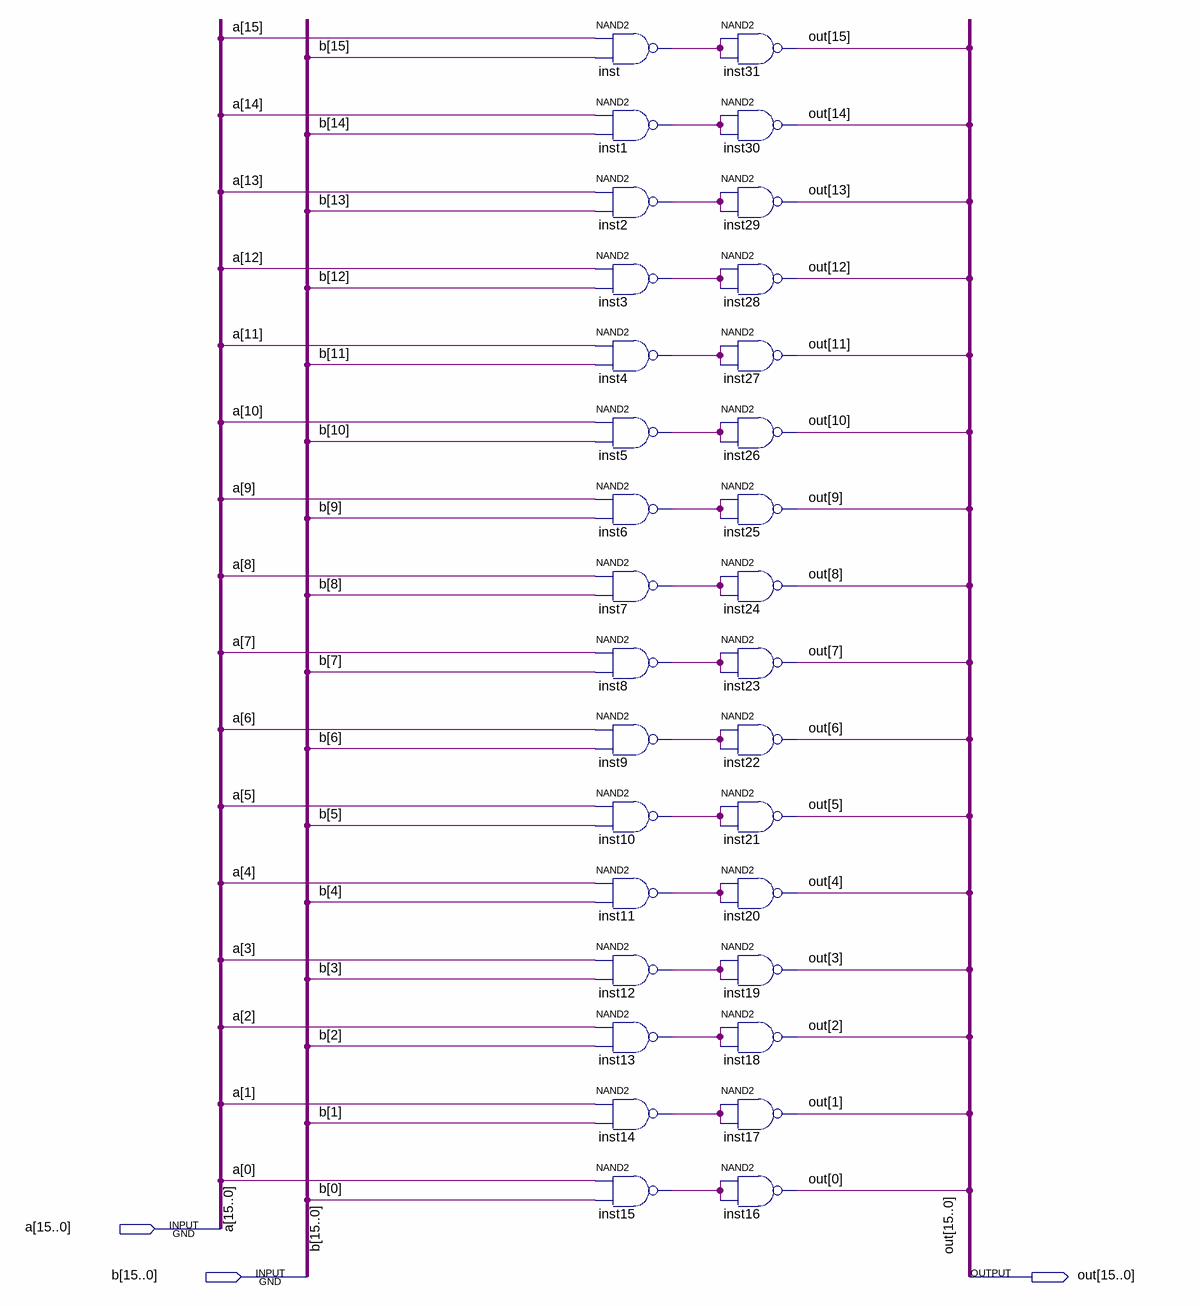
[diagram p0: schematic sheet]
// Quartus schematic And16.bdf as structural Verilog: 32 symbols, 3 pins
module And16 (
  input  [15:0] a,
  input  [15:0] b,
  output [15:0] out
);

  wire inst1_out, inst2_out, inst3_out, inst4_out, inst5_out, inst6_out, inst7_out, inst8_out, inst9_out,
       inst10_out, inst11_out, inst12_out, inst13_out, inst14_out, inst15_out, inst_out;

  nand inst (inst_out, a[15], b[15]);
  nand inst1 (inst1_out, a[14], b[14]);
  nand inst2 (inst2_out, a[13], b[13]);
  nand inst3 (inst3_out, a[12], b[12]);
  nand inst4 (inst4_out, a[11], b[11]);
  nand inst5 (inst5_out, a[10], b[10]);
  nand inst6 (inst6_out, a[9], b[9]);
  nand inst7 (inst7_out, a[8], b[8]);
  nand inst8 (inst8_out, a[7], b[7]);
  nand inst9 (inst9_out, a[6], b[6]);
  nand inst10 (inst10_out, a[5], b[5]);
  nand inst11 (inst11_out, a[4], b[4]);
  nand inst12 (inst12_out, a[3], b[3]);
  nand inst13 (inst13_out, a[2], b[2]);
  nand inst14 (inst14_out, a[1], b[1]);
  nand inst15 (inst15_out, a[0], b[0]);
  nand inst31 (out[15], inst_out, inst_out);
  nand inst30 (out[14], inst1_out, inst1_out);
  nand inst29 (out[13], inst2_out, inst2_out);
  nand inst28 (out[12], inst3_out, inst3_out);
  nand inst27 (out[11], inst4_out, inst4_out);
  nand inst26 (out[10], inst5_out, inst5_out);
  nand inst25 (out[9], inst6_out, inst6_out);
  nand inst24 (out[8], inst7_out, inst7_out);
  nand inst23 (out[7], inst8_out, inst8_out);
  nand inst22 (out[6], inst9_out, inst9_out);
  nand inst21 (out[5], inst10_out, inst10_out);
  nand inst20 (out[4], inst11_out, inst11_out);
  nand inst19 (out[3], inst12_out, inst12_out);
  nand inst18 (out[2], inst13_out, inst13_out);
  nand inst17 (out[1], inst14_out, inst14_out);
  nand inst16 (out[0], inst15_out, inst15_out);
endmodule
